# Altium schematic sheet Jack_Out.SchDoc
size Letter
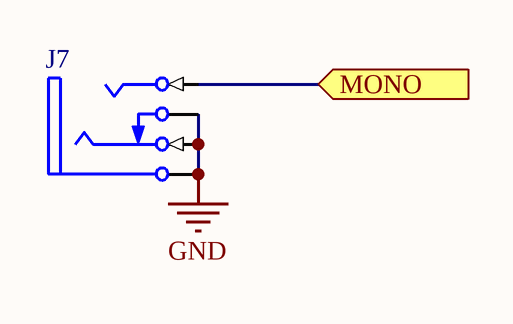
[diagram p0: Jack_Out.SchDoc]

## Parts
J7  Phonejack3 RN  [MHDR1X4]  (value not drawn)

## Ports
MONO (in)

## Nets
GND: J7.3(R) J7.4(RN) J7.5(S)
MONO: J7.1(T) ; port MONO

## Library data of the parts
J7 = Phonejack3 RN: Jack Socket, 1/4" [6.5mm], Thru-Hole, Vertical, 3-Conductor with Tip open & Ring closed; PackageDocument: 2003; PCB_Layout: Complies with manufacturer's recommendation.; DrillAndSlotSize: Corresponds to nominal value.; Published: 15-Jul-2004; DatasheetDocument: 2003; PackageReference: S1VS_SBS; Publisher: Altium Limited; ComponentLink1Description: Manufacturer Link; ComponentLink1URL: http://www.cliffuk.co.uk/